# Altium schematic sheet drvinput5.SchDoc
size A4
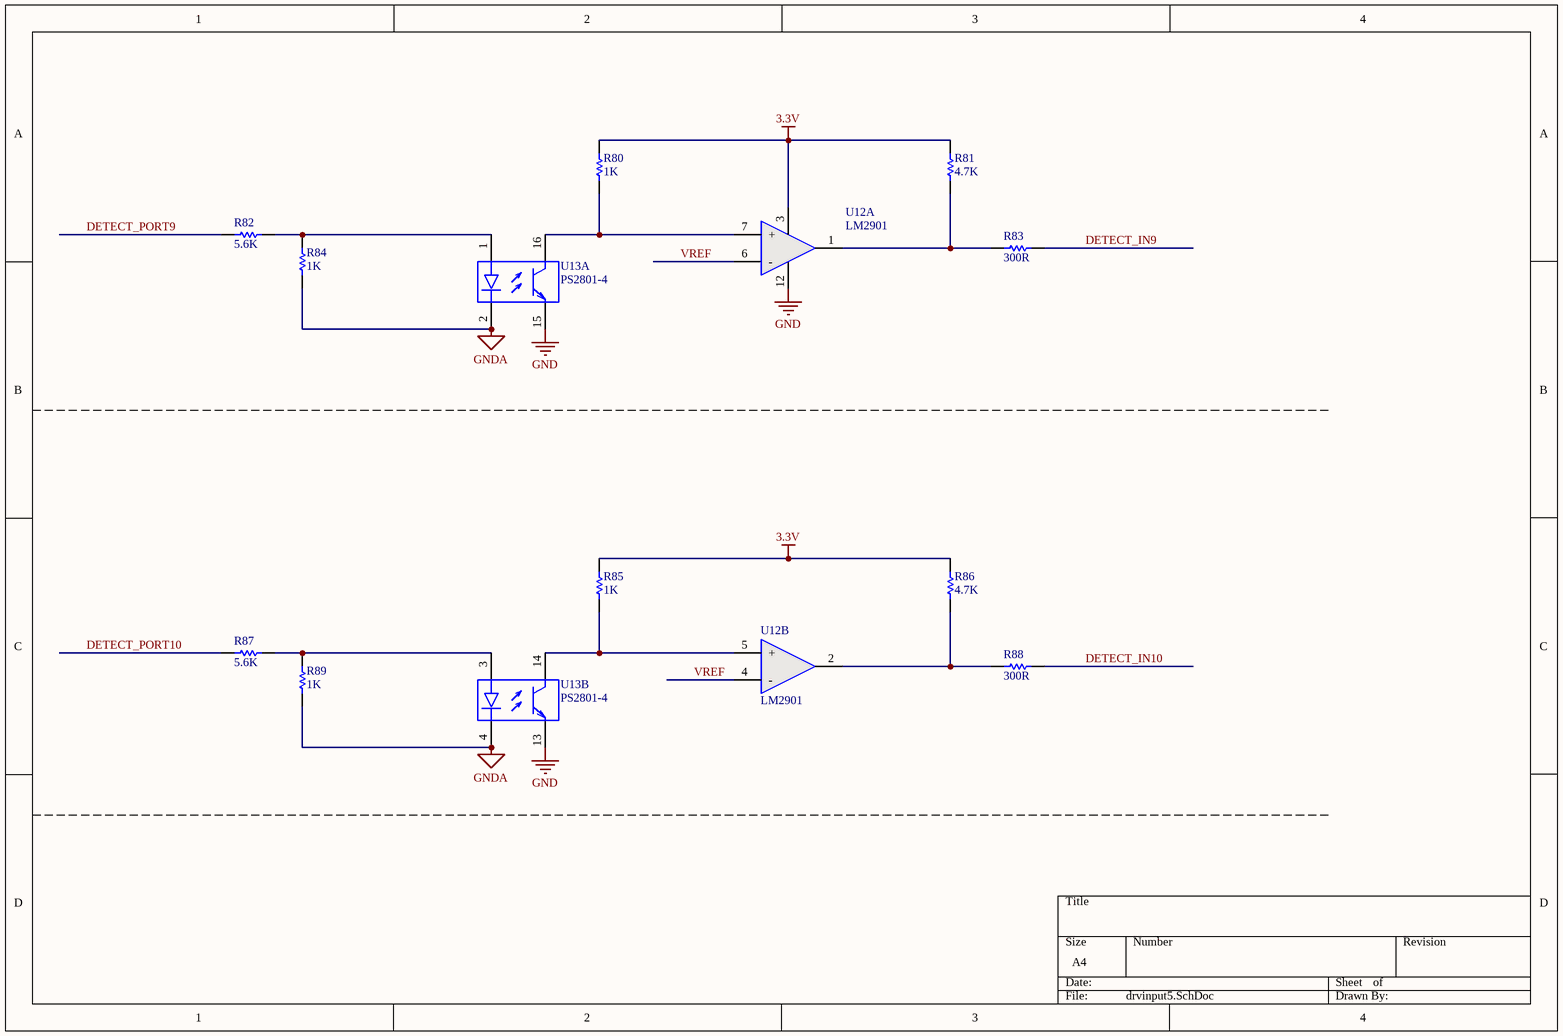
[diagram p0: drvinput5.SchDoc]

## Parts
R80  1K  [RESC2012M]
R81  4.7K  [RESC2012M]
R82  5.6K  [RESC2012M]
R83  300R  [RESC2012M]
R84  1K  [RESC2012M]
R85  1K  [RESC2012M]
R86  4.7K  [RESC2012M]
R87  5.6K  [RESC2012M]
R88  300R  [RESC2012M]
R89  1K  [RESC2012M]
U12  LM2901  [SOIC-14AM]  (parts A,B of 4)
U13  PS2801-4  [SOIC16_N]  (parts A,B of 4)

## Nets
3.3V: R80.1 R81.2 R85.1 R86.2 U12.3(V+)
GND: U12.12(V-) U13.13(E) U13.15(E)
GNDA: R84.1 R89.1 U13.2(-) U13.4(-)
DETECT_IN9: R83.1
DETECT_IN10: R88.2
DETECT_PORT9: R82.2
DETECT_PORT10: R87.2
VREF: U12.4(-) U12.6(-)
NetR80_2: R80.2 U12.7(+) U13.16(C)
NetR81_1: R81.1 R83.2 U12.1(OUT)
NetR82_1: R82.1 R84.2 U13.1(+)
NetR85_2: R85.2 U12.5(+) U13.14(C)
NetR86_1: R86.1 R88.1 U12.2(OUT)
NetR87_1: R87.1 R89.2 U13.3(+)

## Library data of the parts
R80-R87 R89 = Res1: Resistor; Value: 10K; Published: 8-Jun-2000; LatestRevisionDate: 17-Jul-2002; LatestRevisionNote: Re-released for DXP Platform.; PackageReference: AXIAL-0.3; Publisher: Altium Limited
R88 = Res1: Resistor; Value: 470; Published: 8-Jun-2000; LatestRevisionDate: 17-Jul-2002; LatestRevisionNote: Re-released for DXP Platform.; PackageReference: AXIAL-0.3; Publisher: Altium Limited
U12 = LM2901: 4通道差分比较器芯片
U13 = PS2801-4: The PS2801-1 and PS2801-4 are optically coupled isolators containing a GaAs light emitting diode and an NPN  silicon phototransistor in a plastic SOP for high density applications.; Published: 28-Feb-2003; LatestRevisionDate: 13-Apr-2006; LatestRevisionNote: IPC-7351 Footprint Added.; DatasheetVersion: Jan-2002, Rev. 7; PackageVersion: rev7, Jan-2002; PackageReference: 751-07; Publisher: Altium Limited; PackageDescription: 8-Pin Plastic Small Outline Integrated Circuit 1.27 mm Pitch; Code_JEDEC: MS-012-AA; Code_IPC: SOIC127P600-8; ComponentLink1Description: Manufacturer Link; ComponentLink1URL: http://www.onsemi.com/; ComponentLink2Description: Datasheet; ComponentLink2URL: http://www.onsemi.com/pub/Collateral/LM358-D.PDF